# EAGLE design iomodul3 (EAGLE 6.6.0)
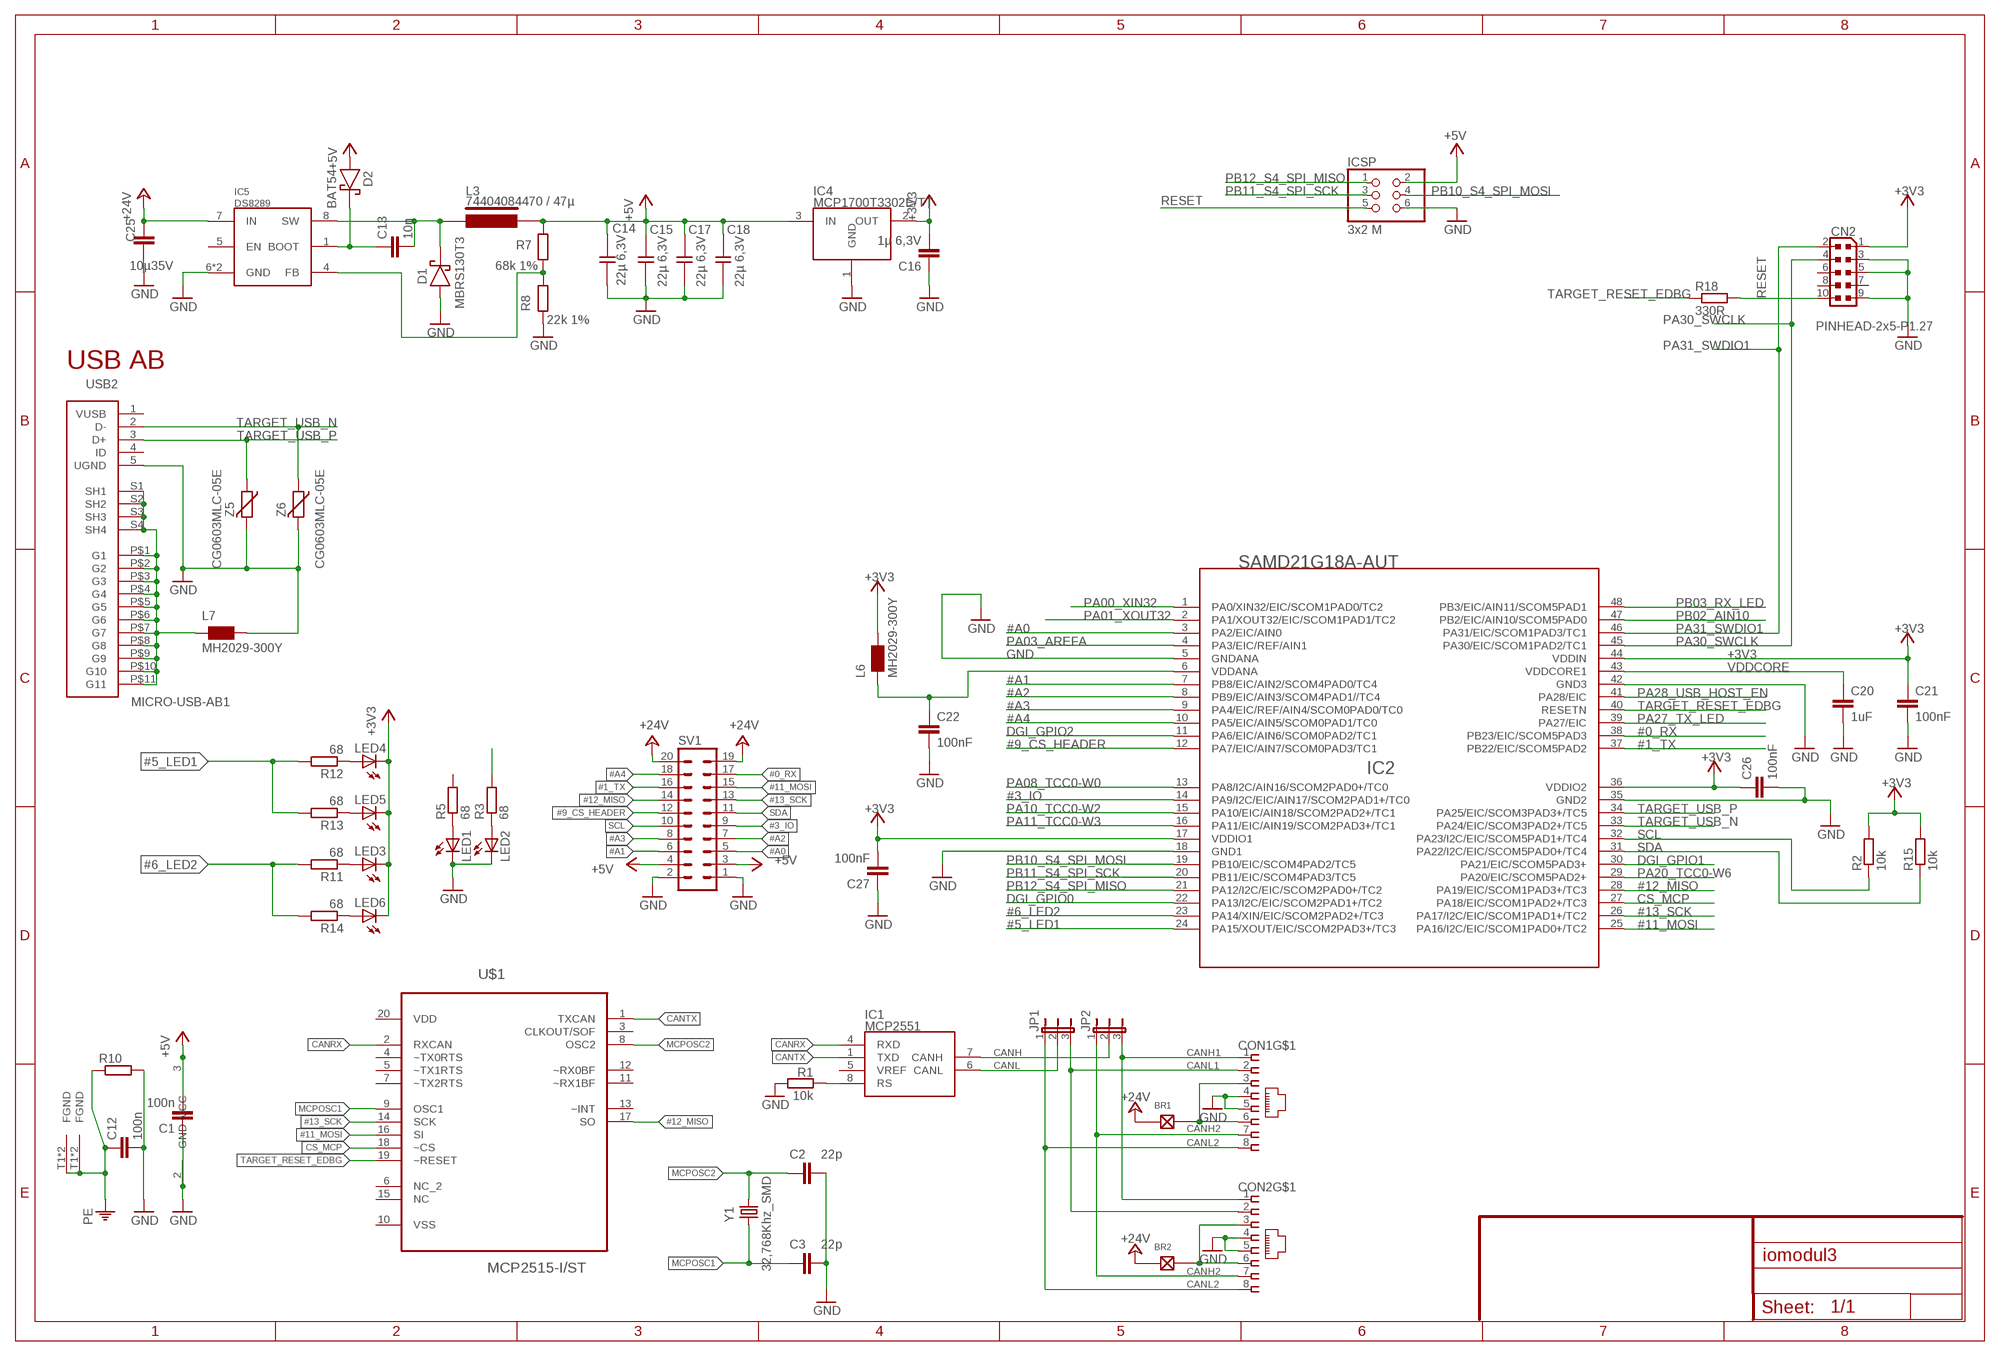
[diagram p0: schematic, sheet 1]

## Parts
BR1  LÖTBRÜCKE-S  [LÖTBRÜCKE]
BR2  LÖTBRÜCKE-S  [LÖTBRÜCKE]
C1  100n  C-EUC0805  [C0805]
C2  22p  C-EUC0805  [C0805]
C3  22p  C-EUC0805  [C0805]
C12  100n  C-EUC0805  [C0805]
C13  10n  C-EUC0805  [C0805]
C14  22µ 6,3V  CAP1210  [1210]
C15  22µ 6,3V  CAP1210  [1210]
C16  1µ 6,3V  C-EUC1206  [C1206]
C17  22µ 6,3V  CAP1210  [1210]
C18  22µ 6,3V  CAP1210  [1210]
C20  1uF  C-EUC0805  [C0805]
C21  100nF  C-EUC0805  [C0805]
C22  100nF  C-EUC0805  [C0805]
C25  10µ35V  C-EUC0805  [C0805]
C26  100nF  C-EUC0805  [C0805]
C27  100nF  C-EUC0805  [C0805]
CN2  PINHEAD-2x5-P1.27  0171_PH127-205DF055G00A  [PINHEAD-2X5-P127]
CON1  MEBP_8-8G  [MEBP]
CON2  MEBP_8-8G  [MEBP]
D1  MBRS130T3  [SMB]
D2  BAT54  [SOT23/32]
IC1  MCP2551  [SO-8]
IC2  SAMD21G18A-AUT  1792_SAMD21G18A-AUT  [TQFP48-7X7]
IC4  MCP1700T3302E/TT  MCP1700  [SOT23]
IC5  DS8289  [SO8-POWERPAD]
ICSP  3x2 M  0114_PH254-203DF118A00V  [2X03]
JP1  JP2E  [JP2]
JP2  JP2E  [JP2]
L3  74404084470 / 47µ  WE-LQS  [WE-LQS]
L6  MH2029-300Y  0001_BLM21PG300SN1D_/_MH2029-300Y  [0805]
L7  MH2029-300Y  0001_BLM21PG300SN1D_/_MH2029-300Y  [0805]
LED1  LEDCHIPLED_0805  [CHIPLED_0805]
LED2  LEDCHIPLED_0805  [CHIPLED_0805]
LED3  LEDCHIPLED_0805  [CHIPLED_0805]
LED4  LEDCHIPLED_0805  [CHIPLED_0805]
LED5  LEDCHIPLED_0805  [CHIPLED_0805]
LED6  LEDCHIPLED_0805  [CHIPLED_0805]
R1  10k  R-EU_R0805  [R0805]
R2  10k  R-EU_R0805  [R0805]
R3  68  R-EU_R0805  [R0805]
R5  68  R-EU_R0805  [R0805]
R7  68k 1%  R-EU_R0805  [R0805]
R8  22k 1%  R-EU_R0805  [R0805]
R10  R-EU_R0805  [R0805]
R11  68  R-EU_R0805  [R0805]
R12  68  R-EU_R0805  [R0805]
R13  68  R-EU_R0805  [R0805]
R14  68  R-EU_R0805  [R0805]
R15  10k  R-EU_R0805  [R0805]
R18  330R  R-EU_R0805  [R0805]
SV1  MA10-2  [MA10-2]
U$1  MCP2515-I/ST  [SOP65P640X110-20N]
USB2  MICRO-USB-AB1  0631_MCR-AB1-S-RA-SMT-TR  [MCR-AB1-S-RA-SMT]
Y1  32,768Khz_SMD  0213_ABS07-32.768KHZ-T  [RESONATOR_EPSON_FC_145]
Z5  CG0603MLC-05E  0010_BRNCG0603MLC-05E  [CT/CN0603]
Z6  CG0603MLC-05E  0010_BRNCG0603MLC-05E  [CT/CN0603]

## Nets
#0_RX: IC2.38(PB23/EIC/SCOM5PAD3) SV1.17
#1_TX: IC2.37(PB22/EIC/SCOM5PAD2) SV1.16
#3_IO: IC2.14(PA9/I2C/EIC/AIN17/SCOM2PAD1+/TC0) SV1.9
#5_LED1: IC2.24(PA15/XOUT/EIC/SCOM2PAD3+/TC3) R12.2 R13.2
#6_LED2: IC2.23(PA14/XIN/EIC/SCOM2PAD2+/TC3) R11.2 R14.2
#9_CS_HEADER: IC2.12(PA7/EIC/AIN7/SCOM0PAD3/TC1) SV1.12
#11_MOSI: IC2.25(PA16/I2C/EIC/SCOM1PAD0+/TC2) SV1.15 U$1.16(SI)
#12_MISO: IC2.28(PA19/EIC/SCOM1PAD3+/TC3) SV1.14 U$1.17(SO)
#13_SCK: IC2.26(PA17/I2C/EIC/SCOM1PAD1+/TC2) SV1.13 U$1.14(SCK)
#A0: IC2.3(PA2/EIC/AIN0) SV1.5
#A1: IC2.7(PB8/EIC/AIN2/SCOM4PAD0/TC4) SV1.6
#A2: IC2.8(PB9/EIC/AIN3/SCOM4PAD1//TC4) SV1.7
#A3: IC2.9(PA4/EIC/REF/AIN4/SCOM0PAD0/TC0) SV1.8
#A4: IC2.10(PA5/EIC/AIN5/SCOM0PAD1/TC0) SV1.18
+3V3: C16.2 C21.1 C26.1 C27.2 CN2.1 IC2.17(VDDIO1) IC2.36(VDDIO2) IC2.44(VDDIN) IC4.2(OUT) L6.2 LED3.C LED4.C LED5.C LED6.C R2.2 R15.2
+5V: C1.2 C14.2 C15.2 C17.2 C18.2 D2.1(A) IC1.3(VCC) IC4.3(IN) ICSP.2 L3.P$2 R7.2 SV1.3 SV1.4
+24V: BR1.1 BR2.1 C25.2 IC5.7(IN) SV1.19 SV1.20
CANH: IC1.7(CANH) JP2.2
CANH1: CON1.1 CON2.1 JP2.3
CANH2: CON1.7 CON2.7 JP2.1
CANL: IC1.6(CANL) JP1.2
CANL1: CON1.2 CON2.2 JP1.3
CANL2: CON1.8 CON2.8 JP1.1
CANRX: IC1.4(RXD) U$1.2(RXCAN)
CANTX: IC1.1(TXD) U$1.1(TXCAN)
CS_MCP: IC2.27(PA18/EIC/SCOM1PAD2+/TC3) U$1.18(~CS)
DGI_GPIO0: IC2.22(PA13/I2C/EIC/SCOM2PAD1+/TC2)
DGI_GPIO1: IC2.30(PA21/EIC/SCOM5PAD3+)
DGI_GPIO2: IC2.11(PA6/EIC/AIN6/SCOM0PAD2/TC1)
GND: C1.1 C2.2 C3.2 C12.2 C14.1 C15.1 C16.1 C17.1 C18.1 C20.2 C21.2 C22.2 C25.1 C26.2 C27.1 CN2.3 CN2.5 CN2.9 CON1.4 CON1.5 CON2.4 CON2.5 D1.A IC1.2(GND) IC2.5(GNDANA) IC2.18(GND1) IC2.35(GND2) IC2.42(GND3) IC4.1(GND) IC5.6(GND) IC5.TP(GND) ICSP.6 L7.2 LED1.C LED2.C R1.2 R8.1 R10.2 SV1.1 SV1.2 USB2.5(UGND) Z5.2 Z6.2
LED2: R3.2
MCPOSC1: C3.1 U$1.9(OSC1) Y1.P$1
MCPOSC2: C2.1 U$1.8(OSC2) Y1.P$2
N$1: IC1.8(RS) R1.1
N$2: BR1.2 CON1.3 CON1.6
N$3: LED2.A R3.1
N$4 [gnd]: L7.1 USB2.P$1(G1) USB2.P$2(G2) USB2.P$3(G3) USB2.P$4(G4) USB2.P$5(G5) USB2.P$6(G6) USB2.P$7(G7) USB2.P$8(G8) USB2.P$9(G9) USB2.P$10(G10) USB2.P$11(G11) USB2.S1(SH1) USB2.S2(SH2) USB2.S3(SH3) USB2.S4(SH4)
N$6: BR2.2 CON2.3 CON2.6
N$7: LED1.A R5.1
N$8: LED5.A R13.1
N$9: LED6.A R14.1
N$10: LED4.A R12.1
N$11: LED3.A R11.1
N$12: C13.1 D2.3(K) IC5.1(BOOT)
N$13: C13.2 D1.K IC5.8(SW) L3.P$1
N$15: C22.1 IC2.6(VDDANA) L6.1
N$18: IC5.4(FB) R7.1 R8.2
PA00_XIN32: IC2.1(PA0/XIN32/EIC/SCOM1PAD0/TC2)
PA01_XOUT32: IC2.2(PA1/XOUT32/EIC/SCOM1PAD1/TC2)
PA03_AREFA: IC2.4(PA3/EIC/REF/AIN1)
PA08_TCC0-W0: IC2.13(PA8/I2C/AIN16/SCOM2PAD0+/TC0)
PA10_TCC0-W2: IC2.15(PA10/EIC/AIN18/SCOM2PAD2+/TC1)
PA11_TCC0-W3: IC2.16(PA11/EIC/AIN19/SCOM2PAD3+/TC1)
PA20_TCC0-W6: IC2.29(PA20/EIC/SCOM5PAD2+)
PA27_TX_LED: IC2.39(PA27/EIC)
PA28_USB_HOST_EN: IC2.41(PA28/EIC)
PA30_SWCLK: CN2.4 IC2.45(PA30/EIC/SCOM1PAD2/TC1)
PA31_SWDIO1: CN2.2 IC2.46(PA31/EIC/SCOM1PAD3/TC1)
PB02_AIN10: IC2.47(PB2/EIC/AIN10/SCOM5PAD0)
PB03_RX_LED: IC2.48(PB3/EIC/AIN11/SCOM5PAD1)
PB10_S4_SPI_MOSI: IC2.19(PB10/EIC/SCOM4PAD2/TC5) ICSP.4
PB11_S4_SPI_SCK: IC2.20(PB11/EIC/SCOM4PAD3/TC5) ICSP.3
PB12_S4_SPI_MISO: IC2.21(PA12/I2C/EIC/SCOM2PAD0+/TC2) ICSP.1
PE: C12.1 CON1.T1(FGND) CON1.T2(FGND) CON2.T1(FGND) CON2.T2(FGND) R10.1
RESET: CN2.10 ICSP.5 R18.2
SCL: IC2.32(PA23/I2C/EIC/SCOM5PAD1+/TC4) R2.1 SV1.10
SDA: IC2.31(PA22/I2C/EIC/SCOM5PAD0+/TC4) R15.1 SV1.11
TARGET_RESET_EDBG: IC2.40(RESETN) R18.1 U$1.19(~RESET)
TARGET_USB_N [USBpair]: IC2.33(PA24/EIC/SCOM3PAD2+/TC5) USB2.2(D-) Z6.1
TARGET_USB_P [USBpair]: IC2.34(PA25/EIC/SCOM3PAD3+/TC5) USB2.3(D+) Z5.1
VDDCORE: C20.1 IC2.43(VDDCORE1)
Unconnected: CN2.6 CN2.7 CN2.8 IC1.5(VREF) IC5.5(EN) R5.2 U$1.3(CLKOUT/SOF) U$1.4(~TX0RTS) U$1.5(~TX1RTS) U$1.6(NC_2) U$1.7(~TX2RTS) U$1.11(~RX1BF) U$1.12(~RX0BF) U$1.13(~INT) U$1.15(NC) USB2.4(ID)

## Notes on the sheet
- USB AB

## Power pins joined to a net without a drawn wire
VDD: U$1.20(VDD)
VSS: U$1.10(VSS)
VUSB: USB2.1(VUSB)

## Library data of the parts
BR1 BR2 = myspecial:LÖTBRÜCKE
C1-C3 C12 C13 C16 C20-C22 C25-C27 = schlager_passiv:C-EU: CAPACITOR, European symbol
C14 C15 C17 C18 = MYPASS:CAP1210
CN2 = Connettori:0171_PH127-205DF055G00A: 2x5 PASSO 1,27
CON1 CON2 = myconn:MEBP_8-8G: Reichelt RJ45 geschirmt MEBP 8-8G
D1 = MYDISCR:MBRS130T3
D2 = MYDISCR:BAT54
IC1 = MYMCHIP:MCP2551: CAN Transceiver
IC2 = IntegratedCircuits:1792_SAMD21G18A-AUT: Atmel D21 32bit ARM Cortex-M0 microcontroller - 48 PIN TQFP 256KB flash memory + 32KB SRAM
IC4 = MYMCHIP:MCP1700: LDO 250mA
IC5 = MYRichtek:DS8289
ICSP = Connettori:0114_PH254-203DF118A00V: 3x2 M V h 8,5 mm p2,54; MONTHLY_USAGE: _____; PART_NUMBER: PH254-203DF118A00V; PRICE: _____; SUPPLIER: _____; TYPE: Connettori; VALUE: ICSP
JP1 JP2 = jumper:JP2E: JUMPER
L3 = myinductiv:WE-LQS
L6 L7 = Protezione:0001_BLM21PG300SN1D_/_MH2029-300Y: BLM21; MONTHLY_USAGE: _____; PART_NUMBER: BLM21PG300SN1D_/_MH2029-300Y; PRICE: _____; SUPPLIER: _____; TYPE: Protezione
LED1-LED6 = led:LED: LED OSRAM: - CHIPLED LG R971, LG N971, LY N971, LG Q971, LY Q971, LO R971, LY R971 LH N974, LH R974 LS Q976, LO Q976, LY Q976 LO Q996 - Hyper CHIPLED LW Q18S LB Q993, LB Q99A, LB R99A - SideLED LS A670, LO A670, LY A670, LG A670, LP A670 LB A673, LV A673, LT A673, LW A673 LH A674 LY A675 LS A676, LA A676, LO A676, LY A676, LW A676 LS A679, LY A679, LG A679 - Hyper Micro SIDELED® LS Y876, LA Y876, LO Y876, LY Y876 LT Y87S - SmartLED LW L88C, LW L88S LB L89C, LB L89S, LG L890 LS L89K, LO L89K, LY L89K LS L896, LA L896, LO L896, LY L896 - TOPLED LS T670, LO T670, LY T670, LG T670, LP T670 LSG T670, LSP T670, LSY T670, LOP T670, LYG T670 LG T671, LOG T671, LSG T671 LB T673, LV T673, LT T673, LW T673 LH T674 LS T676, LA T676, LO T676, LY T676, LB T676, LH T676, LSB T676, LW T676 LB T67C, LV T67C, LT T67C, LS T67K, LO T67K, LY T67K, LW E67C LS E67B, LA E67B, LO E67B, LY E67B, LB E67C, LV E67C, LT E67C LW T67C LS T679, LY T679, LG T679 LS T770, LO T770, LY T770, LG T770, LP T770 LB T773, LV T773, LT T773, LW T773 LH T774 LS E675, LA E675, LY E675, LS T675 LS T776, LA T776, LO T776, LY T776, LB T776 LHGB T686 LT T68C, LB T68C - Hyper Mini TOPLED® LB M676 - Mini TOPLED Santana® LG M470 LS M47K, LO M47K, LY M47K Source: http://www.osram.convergy.de LUXEON: - LUMILED® LXK2-PW12-R00, LXK2-PW12-S00, LXK2-PW14-U00, LXK2-PW14-V00 LXK2-PM12-R00, LXK2-PM12-S00, LXK2-PM14-U00 LXK2-PE12-Q00, LXK2-PE12-R00, LXK2-PE12-S00, LXK2-PE14-T00, LXK2-PE14-U00 LXK2-PB12-K00, LXK2-PB12-L00, LXK2-PB12-M00, LXK2-PB14-N00, LXK2-PB14-P00, LXK2-PB14-Q00 LXK2-PR12-L00, LXK2-PR12-M00, LXK2-PR14-Q00, LXK2-PR14-R00 LXK2-PD12-Q00, LXK2-PD12-R00, LXK2-PD12-S00 LXK2-PH12-R00, LXK2-PH12-S00 LXK2-PL12-P00, LXK2-PL12-Q00, LXK2-PL12-R00 Source: www.luxeon.com KINGBRIGHT: KA-3528ASYC Source: www.kingbright.com
R1-R3 R5 R7 R8 R10-R15 R18 = schlager_passiv:R-EU_: RESISTOR, European symbol
SV1 = con-lstb:MA10-2: PIN HEADER; OC_FARNELL: unknown; OC_NEWARK: unknown
U$1 = CHIP_MCP:MCP2515-I/ST: Stand-Alone CAN Controller; MPN: MCP2515-I/ST; OC_FARNELL: 1196851; OC_NEWARK: 61K2946; PACKAGE: SOP-20; SUPPLIER: Microchip
USB2 = Connettori:0631_MCR-AB1-S-RA-SMT-TR: Usb Micro F/90 Smd Tipo AB; MONTHLY_USAGE: _____; PART_NUMBER: MCR-AB1-S-RA-SMT-TR; PRICE: _____; SUPPLIER: _____; TYPE: Connettori; VALUE: MCR-AB1-S-RA-SMT-TR
Y1 = Cristalli:0213_ABS07-32.768KHZ-T: 32,768KHz - SMD; MONTHLY_USAGE: _____; PART_NUMBER: ABS07-32.768KHZ-T; PRICE: _____; SUPPLIER: _____; TYPE: Cristalli
Z5 Z6 = Protezione:0010_BRNCG0603MLC-05E: CG0603MLC-05E; MONTHLY_USAGE: _____; PART_NUMBER: BRNCG0603MLC-05E; PRICE: _____; SUPPLIER: _____; TYPE: Protezione; VALUE: BRNCG0603MLC-05E

## Net classes
0 default: width 0.203 mm, drill 0.203 mm, clearance 0.178 mm
2 gnd: width 0.254 mm, drill 0.254 mm, clearance 0.178 mm
3 usbvcc: width 0.203 mm, drill 0.406 mm, clearance 0.178 mm
4 USBpair: width 0.254 mm, drill 0.406 mm, clearance 0.508 mm

## Board
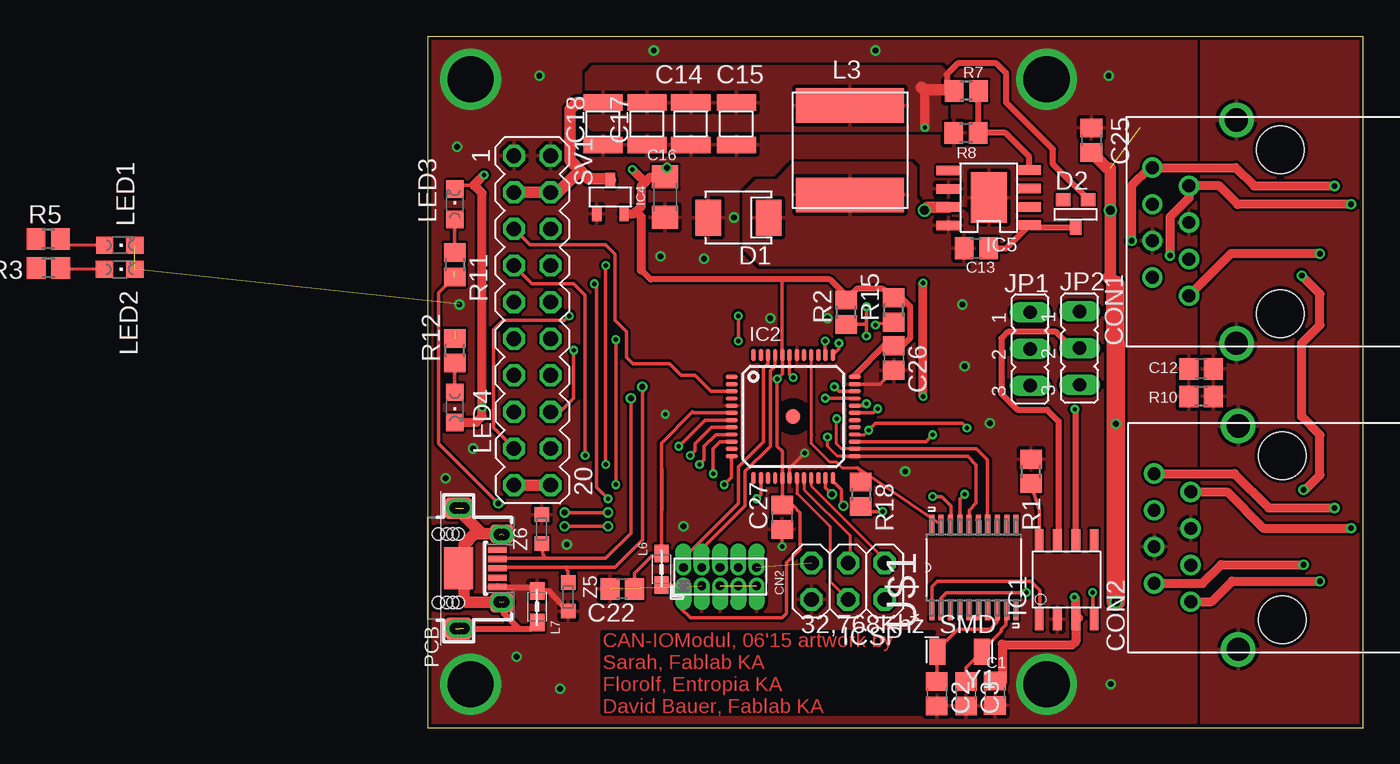
[diagram p1: board, top side]
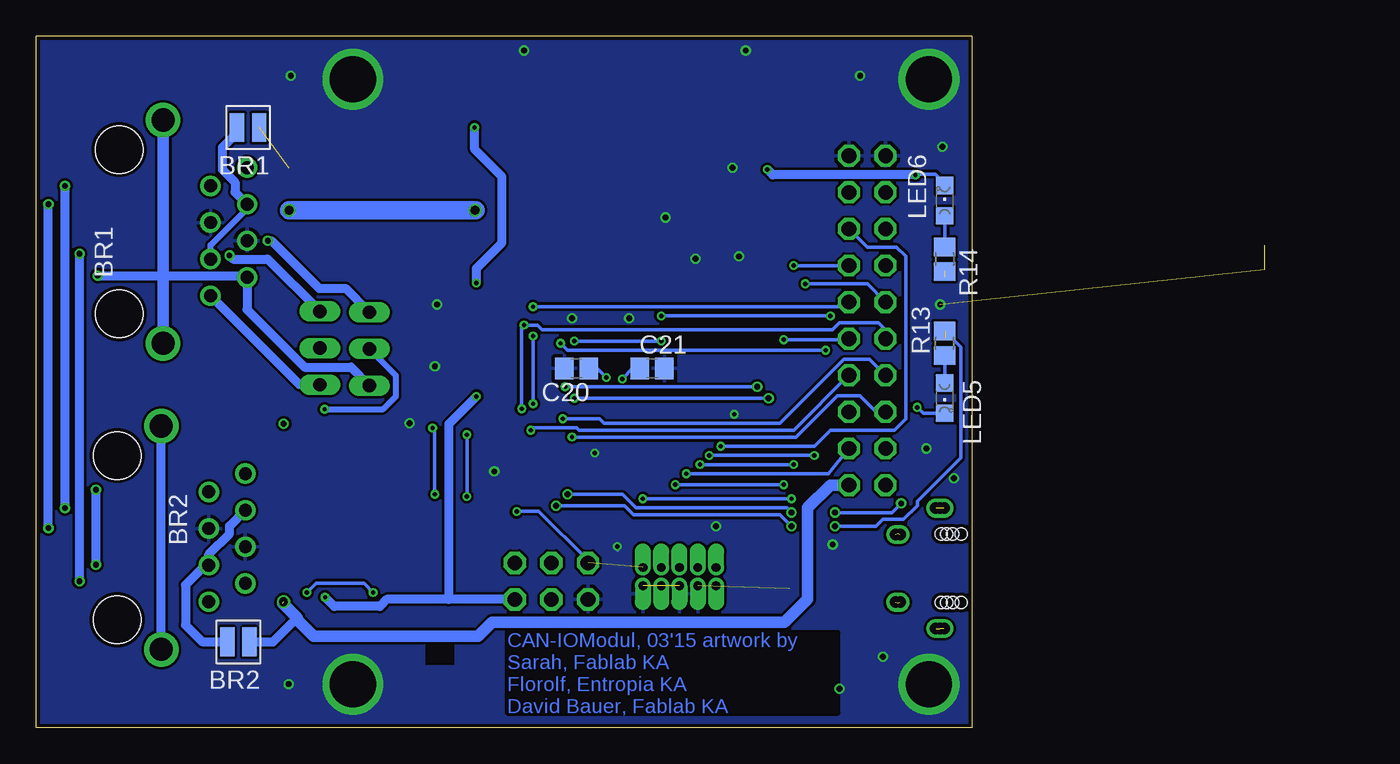
[diagram p2: board, bottom side, seen from below]

Size 65 x 48 mm. Coordinates in mm from the lower left corner, seen from the top.
Outline: 0,0 65,0 65,48 0,48 0,0
Copper layers (1*16): Top 0.035mm / dielectric 1.5mm / Bottom 0.035mm
Design rules "ITEADstudio_DRC": minimum track width 6mil, minimum drill 12mil, track to track 6mil, track to pad 6mil, pad to pad 6mil, via to via 6mil, smd to smd 0mil, copper to edge 10mil, drill to drill 10mil, minimum pad ring 10mil, minimum via ring 6mil, stop-mask expansion 2mil, vias tented up to drill 100mil, thermal gap 10mil

### Footprints (pad centres in the part's own frame; a part is rotated, then mirrored left to right if it is on the bottom)
LÖTBRÜCKE = smd 1 x 2: 1 -0.77,0; 2 0.77,0
C0805 = smd 1.3 x 1.5: 1 -0.85,0; 2 0.85,0
1210 = smd 1.143 x 2.718: 1 -1.473,0; 2 1.473,0
C1206 = smd 1.6 x 1.8: 1 -1.4,0; 2 1.4,0
PINHEAD-2X5-P127 = drill 0.61 pad 1.016 offset: 1 -0.635,2.54; 2 0.635,2.54; 3 -0.635,1.27; 4 0.635,1.27; 5 -0.635,0; 6 0.635,0; 7 -0.635,-1.27; 8 0.635,-1.27; 9 -0.635,-2.54; 10 0.635,-2.54
MEBP = drill 0.9: 1 -4.445,6.35; 2 -3.175,8.89; 3 -1.9,6.35; 4 -0.635,8.89; 5 0.635,6.35; 6 1.9,8.89; 7 3.175,6.35; 8 4.445,8.89 | drill 1.6: T1 -7.75,3.05; T2 7.75,3.05 | hole 3.3: -5.7,0; 5.7,0
SMB = smd 1.8 x 2.5: A 4.4,0; K 0.2,0
SOT23/32 = smd 1 x 0.9: 1 1.431,1.456; 2 -0.3,1.456 | smd 0.8 x 1: 3 0.565,-0.476
SO-8 = smd 0.61 x 1.524: 1 0,-0.203; 2 1.27,-0.203; 3 2.54,-0.203; 4 3.81,-0.203; 5 3.81,5.283; 6 2.54,5.283; 7 1.27,5.283; 8 0,5.283
TQFP48-7X7 = smd 0.85 x 0.32: 1 -4.275,2.75; 2 -4.275,2.25; 3 -4.275,1.75; 4 -4.275,1.25; 5 -4.275,0.75; 6 -4.275,0.25; 7 -4.275,-0.25; 8 -4.275,-0.75; 9 -4.275,-1.25; 10 -4.275,-1.75; 11 -4.275,-2.25; 12 -4.275,-2.75; 25 4.275,-2.75; 26 4.275,-2.25; 27 4.275,-1.75; 28 4.275,-1.25; 29 4.275,-0.75; 30 4.275,-0.25; 31 4.275,0.25; 32 4.275,0.75; 33 4.275,1.25; 34 4.275,1.75; 35 4.275,2.25; 36 4.275,2.75 | smd 0.32 x 0.85: 13 -2.75,-4.275; 14 -2.25,-4.275; 15 -1.75,-4.275; 16 -1.25,-4.275; 17 -0.75,-4.275; 18 -0.25,-4.275; 19 0.25,-4.275; 20 0.75,-4.275; 21 1.25,-4.275; 22 1.75,-4.275; 23 2.25,-4.275; 24 2.75,-4.275; 37 2.75,4.275; 38 2.25,4.275; 39 1.75,4.275; 40 1.25,4.275; 41 0.75,4.275; 42 0.25,4.275; 43 -0.25,4.275; 44 -0.75,4.275; 45 -1.25,4.275; 46 -1.75,4.275; 47 -2.25,4.275; 48 -2.75,4.275 | smd 1 x 1: P$1 0,0
SOT23 = smd 0.65 x 1.05: 1 -0.95,-1.15; 2 0.95,-1.15; 3 0,1.15
SO8-POWERPAD = smd 0.66 x 1.6: 1 -1.905,-2.819; 2 -0.635,-2.819; 3 0.635,-2.819; 4 1.905,-2.819; 5 1.88,2.819; 6 0.61,2.819; 7 -0.66,2.819; 8 -1.93,2.819 | smd 3.5 x 2.5: TP 0,0
2X03 = drill 1.016 pad 1.55 octagon: 1 -2.54,-1.27; 2 -2.54,1.27; 3 0,-1.27; 4 0,1.27; 5 2.54,-1.27; 6 2.54,1.27
JP2 = drill 0.914 long: 1 -2.54,0; 2 0,0; 3 2.54,0
WE-LQS = smd 2.4 x 7.5: P$1 3.1,0; P$2 -3.1,0
0805 = smd 1.2 x 1: 1 -1.1,0; 2 1.1,0
CHIPLED_0805 = smd 1.2 x 1.2: A 0,-1.05; C 0,1.05
R0805 = smd 1.3 x 1.5: 1 -0.85,0; 2 0.85,0
MA10-2 = drill 1.016 octagon: 1 -11.43,-1.27; 2 -11.43,1.27; 3 -8.89,-1.27; 4 -8.89,1.27; 5 -6.35,-1.27; 6 -6.35,1.27; 7 -3.81,-1.27; 8 -3.81,1.27; 9 -1.27,-1.27; 10 -1.27,1.27; 11 1.27,-1.27; 12 1.27,1.27; 13 3.81,-1.27; 14 3.81,1.27; 15 6.35,-1.27; 16 6.35,1.27; 17 8.89,-1.27; 18 8.89,1.27; 19 11.43,-1.27; 20 11.43,1.27
SOP65P640X110-20N = smd 1.422 x 0.356: 1 -2.946,2.921; 2 -2.946,2.286; 3 -2.946,1.626; 4 -2.946,0.965; 5 -2.946,0.33; 6 -2.946,-0.33; 7 -2.946,-0.965; 8 -2.946,-1.626; 9 -2.946,-2.286; 10 -2.946,-2.921; 11 2.946,-2.921; 12 2.946,-2.286; 13 2.946,-1.626; 14 2.946,-0.965; 15 2.946,-0.33; 16 2.946,0.33; 17 2.946,0.965; 18 2.946,1.626; 19 2.946,2.286; 20 2.946,2.921
MCR-AB1-S-RA-SMT = smd 0.4 x 1.35: 1 -1.3,2.7; 2 -0.65,2.7; 3 0,2.7; 4 0.65,2.7; 5 1.3,2.7 | drill 0.8: P$1 -4.175,0.356; P$3 -4.175,0.076; P$4 -4.175,-0.203; P$5 4.175,0.356; P$6 4.175,0.076; P$7 4.175,-0.203 | smd 2.9 x 2: P$2 0,0 | drill 0.8 pad 1.27: P$8 -2.35,3.15; P$9 -2.35,2.85; P$10 2.35,3.15; P$11 2.35,2.85 | smd 1.3 x 1.6: S1 -2.4,3; S2 2.4,3 | smd 1.5 x 1.8: S3 -4.175,0; S4 4.175,0 | hole 0.85: -2.375,0; 2.375,0; -2.375,-1.4; 2.375,-1.4; -2.375,-0.4; 2.375,-0.4; 2.375,-0.8; -2.375,-0.8
RESONATOR_EPSON_FC_145 = smd 1.1 x 1.8: P$1 -1.55,0; P$2 1.55,0
CT/CN0603 = smd 1 x 1: 1 -1,0; 2 1,0

### Placement (x,y rotation side)
BR1  50.28,41.65 180 bottom
BR2  50.95,5.94 180 bottom
C1  39.4,2.38 90 top
C2  35.37,2.35 270 top
C3  37.4,2.35 270 top
C12  53.72,24.89 180 top
C13  38.12,33.27 180 top
C14  18.29,41.91 90 top
C15  21.46,41.91 90 top
C16  16.51,36.83 90 top
C17  15.24,41.91 90 top
C18  12.19,41.91 90 top
C20  27.46,24.92 180 bottom
C21  22.23,24.92 0 bottom
C22  13.53,9.62 180 top
C25  46.1,40.77 270 top
C26  32.38,25.65 270 top
C27  24.64,14.61 90 top
CN2  20.32,10.48 90 top
CON1  59.23,34.42 90 top
CON2  59.35,13.18 90 top
D1  23.9,35.4 180 top
D2  44.45,35.18 0 top
IC1  42.48,7.72 0 top
IC2  25.4,21.59 0 top
IC4  12.7,36.83 0 top
IC5  38.98,36.78 90 top
ICSP  29.21,10.16 180 top
JP1  41.86,26.28 270 top
JP2  45.29,26.34 270 top
L3  29.35,40.07 270 top
L6  16.26,10.99 270 top
L7  7.62,8.38 90 top
LED1  -21.36,33.48 270 top  (outside the outline)
LED2  -21.36,31.81 270 top  (outside the outline)
LED3  1.91,36.32 0 top
LED4  1.91,22.23 180 top
LED5  1.91,22.86 180 bottom
LED6  1.91,36.58 0 bottom
R1  41.91,17.78 90 top
R2  29.08,28.83 90 top
R3  -26.31,31.9 180 top  (outside the outline)
R5  -26.33,33.91 180 top  (outside the outline)
R7  37.43,44.19 180 top
R8  37.4,41.28 0 top
R10  53.72,22.99 180 top
R11  1.91,32.13 270 top
R12  1.91,26.16 90 top
R13  1.91,26.67 90 bottom
R14  1.91,32.51 270 bottom
R15  32.38,28.99 90 top
R18  30.1,16.19 270 top
SV1  7.28,28.26 270 top
U$1  37.94,11.11 90 top
USB2  2.16,11.05 270 top
Y1  36.96,5.27 180 top
Z5  9.78,9.08 270 top
Z6  7.94,13.78 90 top

### Tracks (layer width: path | path; a pad name or v marks a point on that pad's centre or on a via)
#0_RX  (via drill 0.3)
  Top 0.254: v6.01,19.39 4.6,20.8 4.6,27.62 5.24,28.26 9.53,28.26 v9.84,28.57 | v21.59,28.57 v21.59,26.83 | v27.62,26.83 27.62,25.89 IC2.38
  Bottom 0.254: SV1.17 v6.01,19.39 | v9.84,28.57 v21.59,28.57 | v21.59,26.83 v27.62,26.83
#1_TX  (via drill 0.3)
  Top 0.254: SV1.16 9.21,21.91 10.16,22.86 v10.16,26.19 | v28.57,26.67 28.57,26.29 IC2.37
  Bottom 0.254: v10.16,26.19 28.1,26.19 v28.57,26.67
#3_IO  (via drill 0.3)
  Top 0.254: v11.59,30.8 11.75,30.64 11.75,16.67 v12.54,15.88 | IC2.14 23.15,16.16 v22.86,15.88
  Bottom 0.254: v11.59,30.8 7.28,30.8 SV1.9 | v22.86,15.88 v12.54,15.88
#5_LED1  (via drill 0.4)  (1 unrouted)
  Top 0.254: IC2.24 28.15,17.09 28.73,16.51 28.73,15.56 v28.89,15.4 | v12.54,13.97 v9.53,13.97
  Bottom 0.254: v28.89,15.4 24.13,15.4 23.5,14.76 13.34,14.76 v12.54,13.97 | v9.53,13.97 6.67,13.97 6.19,14.45 4.76,14.45 3.81,15.4 3.81,15.72 0.79,18.73 0.79,26.41 R13.2
#6_LED2  (via drill 0.4)  (1 unrouted)
  Top 0.254: IC2.23 27.65,16.64 v28.1,16.19 | R11.2 0.79,30.17 0.79,19.68 3.89,16.59 v4.92,15.56 | v12.54,14.92 v9.53,14.92
  Bottom 0.254: v28.1,16.19 24.29,16.19 23.34,15.24 12.86,15.24 v12.54,14.92 | v9.53,14.92 5.56,14.92 v4.92,15.56
#9_CS_HEADER  (via drill 0.3)
  Top 0.254: IC2.12 21.12,17.38 v20.61,16.86 | v13.08,16.86 v13.08,26.92
  Bottom 0.254: v13.08,26.92 8.62,26.92 SV1.12 | v13.08,16.86 v20.61,16.86
#11_MOSI  (via drill 0.3)
  Top 0.203: 28.79,18.84 28.47,18.84 27.78,19.53 v27.78,20.16
  Top 0.254: 28.79,18.84 IC2.25 37.52,18.84 38.1,18.26 38.1,15.56 37.62,15.08 37.62,14.07 U$1.16 | 27.78,19.84 v27.78,20.16
  Bottom 0.254: SV1.15 6.67,21.91 7.78,23.02 9.37,23.02 12.22,20.16 v27.78,20.16
#12_MISO  (via drill 0.3)
  Top 0.203: IC2.28 30.34,20.34 v30.64,20.64
  Top 0.254: U$1.17 36.98,15.86 v37.31,16.19 | v37.47,20.8 37.15,21.11 31.11,21.11 v30.64,20.64
  Bottom 0.254: SV1.14 8.57,24.45 12.38,20.64 27.3,20.64 27.46,20.8 30.48,20.8 v30.64,20.64 | v37.31,16.19 37.31,20.48 v37.47,20.8
#13_SCK  (via drill 0.3)
  Top 0.203: IC2.26 28.76,19.34 28.42,19.68 v28.42,21.43
  Top 0.254: IC2.26 38.13,19.34 38.89,18.57 38.89,14.07 U$1.14
  Bottom 0.254: v28.42,21.43 25.88,21.43 25.56,21.11 13.34,21.11 8.89,25.56 7.12,25.56 SV1.13
#A0
  Top 0.254: SV1.5 7.12,33.5 12.38,33.5 13.02,32.86 13.02,28.26 13.81,27.46 13.81,25.72 14.29,25.24 16.83,25.24 17.62,24.45 18.57,24.45 19.68,23.34 IC2.3
#A1  (via drill 0.3)
  Top 0.254: IC2.7 19.28,21.34 v17.46,19.53
  Bottom 0.254: v17.46,19.53 10.95,19.53 9.84,20.64 5.4,20.64 4.6,21.43 4.6,32.7 5.24,33.34 7.28,33.34 SV1.6
#A2  (via drill 0.3)
  Top 0.254: IC2.8 19.73,20.84 18.57,19.68 18.57,19.21 v18.26,18.89 | v10.95,18.89 10.95,30 10.16,30.8 7.28,30.8 SV1.7
  Bottom 0.254: v18.26,18.89 v10.95,18.89
#A3  (via drill 0.3)
  Top 0.254: v12.38,18.26 v12.38,32.07 | IC2.9 20.02,20.34 19.21,19.53 19.21,18.57 v18.89,18.26
  Bottom 0.254: v18.89,18.26 v12.38,18.26 | v12.38,32.07 SV1.8
#A4  (via drill 0.3)
  Top 0.254: IC2.10 20.32,19.84 19.84,19.37 v19.84,17.62
  Bottom 0.254: v19.84,17.62 9.98,17.62 SV1.18
+3V3  (via drill 0.3)
  Top 0.254: 32.98,26.5 C26.1 32.35,26.54 31.75,26.54 | 33.02,29.72 32.42,29.72 R15.2 | IC2.36 29.68,24.47 | L6.2 17.74,9.89 CN2.1 17.62,9.68 17.62,8.26 18.26,7.62 24.61,7.62 24.92,7.94 24.92,11.43 25.88,12.38 25.88,14.92 25.34,15.46 C27.2 IC2.17 24.65,19.16 24.29,19.53 v24.29,24.2 24.65,24.56 IC2.44 24.61,25.91 24.61,31.11 | 2.29,37.37 LED3.C 2.16,37.63 3.21,37.63 3.37,37.47 3.43,37.47
  Top 0.406: 32.98,26.5 33.53,27.05 33.53,29.21 33.02,29.72 | 29.68,24.47 31.75,26.54 | R15.2 31.58,30.48 29.84,30.48 29.08,29.72 R2.2 29.08,29.97 27.94,31.11 24.61,31.11 15.49,31.11 14.86,31.75
  Top 0.61: LED4.C 3.4,21.18 3.81,21.59 v3.81,22.23 3.81,37.08 3.43,37.47 | IC4.2 14.34,35.68 14.48,35.81 | 14.48,35.81 14.86,36.2 14.86,37.59 15.11,37.85 | 15.11,37.85 15.49,38.23 C16.2 | 3.21,37.63 v3.94,38.35 | v14.22,38.73 15.11,37.85 | 14.86,31.75 14.86,35.43 14.48,35.81
  Bottom 0.254: LED5.C 3.4,21.81 v3.81,22.23 | LED6.C 1.91,37.78 2.54,38.42 3.87,38.42 v3.94,38.35 | C21.1 23.57,24.92 v24.29,24.2
  Bottom 0.61: v3.94,38.35 13.84,38.35 v14.22,38.73
+5V  (via drill 0.3)
  Top 0.406: D2.1 45.88,36.67 43.43,39.12 43.43,40.13 40.2,43.37 40.2,45.4 39.5,46.1 36.83,46.1 36.07,45.34 36.07,44.26 R7.2
  Top 0.61: IC1.3 45.02,7.81 45.21,7.62 | v34.42,22.99 v34.42,30.86 | v34.54,41.66 34.54,44.2 34.48,44.26 | IC1.3 45.02,5.97 44.77,5.71 40.01,5.71 39.91,5.81 39.91,3.11 C1.2 | IC1.3 45.02,8.96 v44.93,9.05
  Top 0.813: 36.07,44.26 34.48,44.26 34.29,44.45 | C18.2 10.36,43.38 9.91,42.93 9.91,39.37 10.6,38.67 | 10.6,38.67 11.18,38.1 12.58,38.1 IC4.3 | SV1.3 SV1.4 9.08,37.15 10.6,38.67
  Bottom 0.61: 36.32,8.89 36.32,21.08 v34.42,22.99 | v34.42,30.86 34.42,31.88 32.64,33.66 32.64,38.23 34.54,40.13 v34.54,41.66 | ICSP.2 36.32,8.89 | 36.32,8.89 40.64,8.89 41.12,8.41 44.29,8.41 v44.93,9.05
  pour Top (rank 3): 17.08,41.46 35.69,41.46 36.05,41.82 36.05,45.45 35.65,45.85 11.51,45.85 11.04,45.38 11.04,41.9 11.46,41.48 11.98,41.48
+24V  (via drill 0.4, 0.6)  (2 unrouted)
  Top 0.3: 47.62,22.67 47.79,22.84 | 47.8,21.69 47.8,22.06 47.79,22.06 | v47.8,21.08 47.8,20.57
  Top 0.6: 47.78,15.05 v47.81,8.73
  Top 0.8: IC5.7 34.72,36.12 v34.51,35.91
  Top 0.813: 47.25,31.24 47.42,31.07 | 47.42,31.07 v47.42,35.91 47.42,38.81 47.2,38.81 C25.2 | 47.42,31.07 47.76,30.73 | SV1.20 SV1.19
  Top 1.27: v47.81,8.73 v47.8,21.08 47.8,21.69 47.79,22.84 47.76,30.73
  Bottom 0.3: 47.77,21.05 v47.8,21.08
  Bottom 0.61: BR2.1 48.54,5.94 46.93,7.56 46.86,7.62
  Bottom 0.813: 46.86,7.62 47.88,8.64 | SV1.20 9.84,16.83 11.43,15.24 11.43,8.89 13.02,7.3 33.34,7.3 34.29,6.35 45.72,6.35 46.93,7.56
  Bottom 1.27: v47.42,35.91 v34.51,35.91 34.49,35.91
CANH
  Top 0.406: JP2.2 44.78,26.34 43.66,27.46 40.32,27.46 39.85,26.99 39.85,23.18 40.96,22.07 43.02,22.07 43.81,21.27 43.81,13.07 IC1.7
CANH1  (via drill 0.4)
  Top 0.61: CON2.1 54.45,8.73 55.88,10.16 v61.98,10.16 | v61.98,32.89 55.8,32.89 CON1.1
  Bottom 0.61: JP2.3 46.7,23.8 CON1.1 | v61.98,10.16 v61.98,32.89
CANH2  (via drill 0.4)
  Top 0.61: CON2.7 55.53,16.36 58.04,13.84 v64.14,13.84 | v64.14,36.32 56.26,36.32 54.99,37.59 CON1.7 52.88,36.75 51.56,35.43 v51.56,32.77
  Bottom 0.61: v64.14,13.84 v64.14,36.32 | v51.56,32.77 51.31,32.51 48.92,32.51 JP2.1
CANL  (via drill 0.3)
  Top 0.406: IC1.6 45.02,22.04 v44.96,22.1
  Bottom 0.406: v44.96,22.1 40.89,22.1 40.01,22.99 40.01,24.43 JP1.2
CANL1  (via drill 0.4)
  Top 0.61: CON2.2 53.82,10.01 55.12,11.3 v60.83,11.3 | v60.83,16.51 60.96,16.51 61.98,17.53 61.98,20.32 60.71,21.59 60.71,26.67 61.98,27.94 61.98,30.1 v60.71,31.37
  Bottom 0.61: JP1.3 43.13,25.02 46.35,25.02 50.34,29 CON1.2 50.46,31.37 v60.71,31.37 | v60.83,11.3 v60.83,16.51
CANL2  (via drill 0.4)
  Top 0.61: v62.99,37.59 57.4,37.59 56.13,38.87 CON1.8 50.17,38.87 48.9,37.59 v48.9,33.78 | CON2.8 56.03,17.62 58.42,15.24 v62.99,15.24
  Bottom 0.61: v62.99,37.59 v62.99,15.24 | v48.9,33.78 48.64,33.78 45.34,30.48 43.52,30.48 JP1.1
CANRX  (via drill 0.3)
  Top 0.254: U$1.2 35.66,8.98 36.04,9.37 v41.59,9.37 | v46.2,9.37 46.2,7.62 IC1.4
  Bottom 0.254: v41.59,9.37 42.23,10 45.56,10 v46.2,9.37
CANTX
  Top 0.254: U$1.1 35.02,9.78 35.4,10.16 41.91,10.16 42.55,9.53 42.55,7.59 IC1.1
CS_MCP  (via drill 0.3)
  Top 0.254: IC2.27 34.6,19.84 v35.08,20.32 | v35.08,16.03 35.72,16.03 36.35,15.4 36.35,14.1 U$1.18
  Bottom 0.254: v35.08,20.32 v35.08,16.03
GND  (via drill 0.3, 0.4, 3.2)  (4 unrouted)
  Top 0.254: IC2.35 31.42,23.84 C26.2 | C27.1 v24.64,12.57 | IC2.18 25.15,18.01 v26.19,19.05
  Top 0.406: USB2.5 7.35,9.75 L7.2 8.45,9.48 Z5.2
  Bottom 0.254: v24.64,12.57 24.64,12.32
  other vias: 16.64,38.86 21.29,35.4 3,3 3,45 43,3 43,45 16.51,21.75 3.17,19.37 1.27,17.3 6.19,4.92 9.21,2.7 47.47,3.02 39.05,21.11 37.31,25.08 37.15,29.37 19.21,32.54 16.19,32.7 2.06,40.32 2.22,29.37 7.78,45.24 47.31,45.24 15.72,46.99 31.11,46.99 17.78,13.97 33.18,17.78 9.68,12.7 23.81,28.42 27.78,28.42
  pour Top (rank 5): -0.01,47.96 53.11,47.96 53.66,47.35 53.75,0.76 53.05,0.05 0.03,0.05 0.02,7.33 0.03,46.33
  pour Bottom (rank 3): 0,48 64.95,48 65.02,0 0.07,0
MCPOSC1
  Top 0.254: C3.1 37.4,4.17 Y1.P$1 38.51,5.33 39.85,6.67 39.85,6.83 40.16,7.14 40.16,8.1 U$1.9
MCPOSC2
  Top 0.254: C2.1 35.37,5.23 Y1.P$2 35.41,5.4 36.83,6.83 39.05,6.83 39.53,7.3 39.53,8.13 U$1.8
N$1
  Top 0.254: IC1.8 42.48,15.09 R1.1
N$2
  Bottom 0.406: CON1.3 52.88,33.48 50.34,36.02 CON1.6
  Bottom 0.61: BR1.2 51.05,41.28 52.07,40.26 52.07,38.73 51.18,37.85 51.18,37.16 CON1.6
N$3
  Top 0.203: LED2.A -25.37,31.81 R3.1
N$4  (10 unrouted)
  Top 0.406: USB2.P$6 6.35,6.87 | 6.35,6.87 7.21,6.87 L7.1 | USB2.P$10 5.31,7.92 6.35,6.87
  Top 0.813: USB2.P$11 2.73,8.7 2.54,8.89 2.54,10.67 USB2.P$2 2.54,11.43 2.54,12.7 3.29,13.45 3.81,13.45 | USB2.S1 3.81,13.45 | USB2.P$1 2.52,14.74 3.81,13.45
N$6
  Bottom 0.61: BR2.2 51.74,5.97 53.47,5.97 54.61,7.11 54.61,9.91 53.24,11.28 CON2.3 53,12.02 51.56,13.46 51.56,13.98 CON2.6
N$7
  Top 0.203: LED1.A -25.05,33.48 R5.1
N$8
  Bottom 0.254: R13.1 LED5.A
N$9
  Bottom 0.254: LED6.A R14.1
N$10
  Top 0.254: LED4.A R12.1
N$11
  Top 0.254: R11.1 LED3.A
N$12
  Top 0.4: C13.1 40.19,33.27 IC5.1
  Top 0.406: D2.3 41.97,34.7 IC5.1
N$13
  pour Top (rank 4): 25.47,39.17 33.57,39.17 33.88,38.86 33.88,36.74 34.65,35.97 37.12,35.97 37.93,35.16 37.98,32.65 37.44,32.11 23.16,32.08 21.97,33.27 21.97,37.08 22.86,37.97 24.27,37.97
N$15
  Top 0.254: 16.28,17.94 L6.1 | L6.1 16.26,19.75 18.41,21.91 18.48,21.84 IC2.6 | C22.1 14.38,10.72 15.56,11.91 16.08,11.91 L6.1
N$18
  Top 0.406: IC5.4 41.8,39.61 40.13,41.27 38.83,41.27 R8.2 38.25,44.16 R7.1
PA30_SWCLK
  Top 0.254: CN2.4 19.05,12.38 22.07,15.4 22.07,17.78 23.81,19.53 23.81,24.77 24.13,25.08 24.13,25.84 IC2.45
PA31_SWDIO1
  Top 0.254: CN2.2 17.78,11.75 21.59,15.56 21.59,18.1 23.34,19.84 23.34,24.92 23.65,25.24 IC2.46
PB10_S4_SPI_MOSI
  Top 0.203: IC2.19 25.65,16.26 27.94,13.97 27.94,10.16 ICSP.4
PB11_S4_SPI_SCK
  Top 0.203: IC2.20 26.15,16.52 29.34,13.34 29.34,11.56 ICSP.3
PB12_S4_SPI_MISO
  Top 0.203: IC2.21 26.65,16.78 31.5,11.94 31.5,11.68 ICSP.1
PE
  Bottom 0.61: CON2.T1 CON2.T2
  Bottom 0.813: CON1.T2 CON1.T1
  pour Top (rank 4): 53.77,48 65,48 65,0 53.77,0
RESET  (via drill 0.3)  (1 unrouted)
  Top 0.254: v31.62,14.99 30.14,14.99 R18.2
  Bottom 0.254: ICSP.5 26.67,11.6 30.1,15.03 31.58,15.03 v31.62,14.99
SCL  (via drill 0.3)
  Top 0.254: v30.48,22.48 30.35,22.35 29.69,22.35 IC2.32 | v30.48,27.18 30.48,27.94 | 30.48,27.94 v30.48,29.21 | R2.1 30.44,27.98 30.48,27.94
  Bottom 0.254: SV1.10 8.57,29.53 8.89,29.21 v30.48,29.21 | v30.48,22.48 v30.48,27.18
SDA  (via drill 0.3)
  Top 0.254: v31.27,22.13 30.99,21.84 IC2.31 | R15.1 31,27.98 v31.11,27.94
  Bottom 0.254: SV1.11 6.01,27.6 6.51,28.1 9.21,28.1 9.68,27.62 29.84,27.62 30.16,27.94 v31.11,27.94 31.27,27.78 v31.27,22.13
TARGET_RESET_EDBG
  Top 0.203: U$1.19 29.84,18.03 28.8,18.03 28.42,18.41 27.94,18.41 26.67,19.68 26.67,20.32 26.65,20.34 IC2.40
  Top 0.254: R18.1 30.1,17.78 29.84,18.03
TARGET_USB_N  (via drill 0.3, 0.41)
  Top 0.254: IC2.33 27.96,22.84 27.94,22.86 v27.62,22.86 | v14.13,22.86 14.13,13.49 12.38,11.75 8.26,11.75 | 8.26,11.75 4.91,11.75 USB2.2 | Z6.1 8.02,11.99 8.26,11.75
  Bottom 0.254: v27.62,22.86 v14.13,22.86
TARGET_USB_P  (via drill 0.3, 0.41)
  Top 0.254: IC2.34 28.57,23.34 v28.26,23.65 | v14.92,23.65 14.92,13.02 13.02,11.11 9.53,11.11 | 9.53,11.11 4.92,11.11 USB2.3 | Z5.1 9.78,10.86 9.53,11.11
  Bottom 0.254: v28.26,23.65 v14.92,23.65
VDDCORE  (via drill 0.3)
  Top 0.254: IC2.43 25.15,24.54 v25.4,24.29
  Bottom 0.254: C20.1 26.04,24.92 25.8,24.69 v25.4,24.29

### Text on the board
Top: CAN-IOModul, 06'15 artwork by / Sarah, Fablab KA / Florolf, Entropia KA / David Bauer, Fablab KA
Bottom: CAN-IOModul, 03'15 artwork by / Sarah, Fablab KA / Florolf, Entropia KA / David Bauer, Fablab KA
_bNames: BR1 | BR2